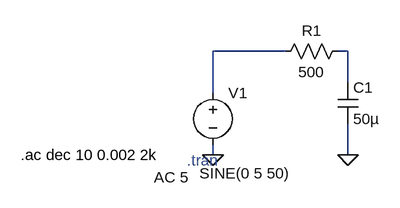
[diagram p0: schematic Low pass RC filter.asc]
Low pass RC filter.asc, the LTspice schematic file:
Version 4.1
SHEET 1 880 680
WIRE 176 -80 64 -80
WIRE 272 -80 256 -80
WIRE 272 -32 272 -80
WIRE 64 -16 64 -80
WIRE 64 80 64 64
WIRE 272 80 272 32
FLAG 272 80 0
FLAG 64 80 0
SYMBOL voltage 64 -32 R0
WINDOW 123 -91 146 Left 2
WINDOW 39 0 0 Left 0
WINDOW 3 -21 140 Left 2
SYMATTR Value2 AC 5
SYMATTR InstName V1
SYMATTR Value SINE(0 5 50)
SYMBOL res 272 -96 R90
WINDOW 0 0 56 VBottom 2
WINDOW 3 32 56 VTop 2
SYMATTR InstName R1
SYMATTR Value 500
SYMBOL cap 256 -32 R0
SYMATTR InstName C1
SYMATTR Value 50µ
TEXT 24 88 Left 2 ;.tran
TEXT -232 80 Left 2 !.ac dec 10 0.002 2k

The netlist it stands for:
* Low pass RC filter.asc
V1 N001 0 SINE(0 5 50) AC 5
R1 N002 N001 500
C1 N002 0 50µ
* .tran
.ac dec 10 0.002 2k
.backanno
.end